# Vivado block design design_1, xcku5p-ffvb676-2-e, Vivado 2018.1_AR73068
# (continued, part 2 of 4)
current_bd_instance /ShaderCoreSystem

create_bd_cell -type ip -vlnv xilinx.com:ip:blk_mem_gen:8.4 VB_Cache
set_property -dict [list \
  CONFIG.Enable_32bit_Address false \
  CONFIG.Use_Byte_Write_Enable false \
  CONFIG.Write_Depth_A 1024 \
  CONFIG.Operating_Mode_A NO_CHANGE \
  CONFIG.Register_PortA_Output_of_Memory_Primitives false \
  CONFIG.Use_RSTA_Pin false \
  CONFIG.use_bram_block Stand_Alone \
] [get_bd_cells VB_Cache]
create_bd_cell -type ip -vlnv xilinx.com:ip:blk_mem_gen:8.4 InstructionCache
set_property -dict [list \
  CONFIG.Enable_32bit_Address false \
  CONFIG.Use_Byte_Write_Enable false \
  CONFIG.Write_Width_A 64 \
  CONFIG.Write_Depth_A 512 \
  CONFIG.Read_Width_A 64 \
  CONFIG.Operating_Mode_A NO_CHANGE \
  CONFIG.Register_PortA_Output_of_Memory_Primitives true \
  CONFIG.Register_PortA_Output_of_Memory_Core true \
  CONFIG.Use_RSTA_Pin false \
  CONFIG.use_bram_block Stand_Alone \
] [get_bd_cells InstructionCache]
create_bd_cell -type hier GPRQuadSystem
create_bd_cell -type ip -vlnv xilinx.com:ip:blk_mem_gen:8.4 ConstantBuffer_BRAM
set_property -dict [list \
  CONFIG.Enable_32bit_Address false \
  CONFIG.Use_Byte_Write_Enable false \
  CONFIG.Write_Depth_A 1024 \
  CONFIG.Operating_Mode_A NO_CHANGE \
  CONFIG.Register_PortA_Output_of_Memory_Primitives true \
  CONFIG.Register_PortA_Output_of_Memory_Core true \
  CONFIG.Use_RSTA_Pin false \
  CONFIG.use_bram_block Stand_Alone \
] [get_bd_cells ConstantBuffer_BRAM]
create_bd_cell -type module -reference UNORM8ToFloat UNORM8ToFloat_0
create_bd_cell -type module -reference VertexStreamCache VertexStreamCache_0
create_bd_cell -type module -reference ConstantBuffer ConstantBuffer_0
create_bd_cell -type module -reference FloatALU FloatALU_0
create_bd_cell -type module -reference FloatALU FloatALU_1
create_bd_cell -type module -reference FloatALU FloatALU_2
create_bd_cell -type module -reference FloatALU FloatALU_3
create_bd_cell -type module -reference ShaderCore ShaderCore_0

# ---- hierarchy /ShaderCoreSystem/GPRQuadSystem ----
current_bd_instance /ShaderCoreSystem/GPRQuadSystem
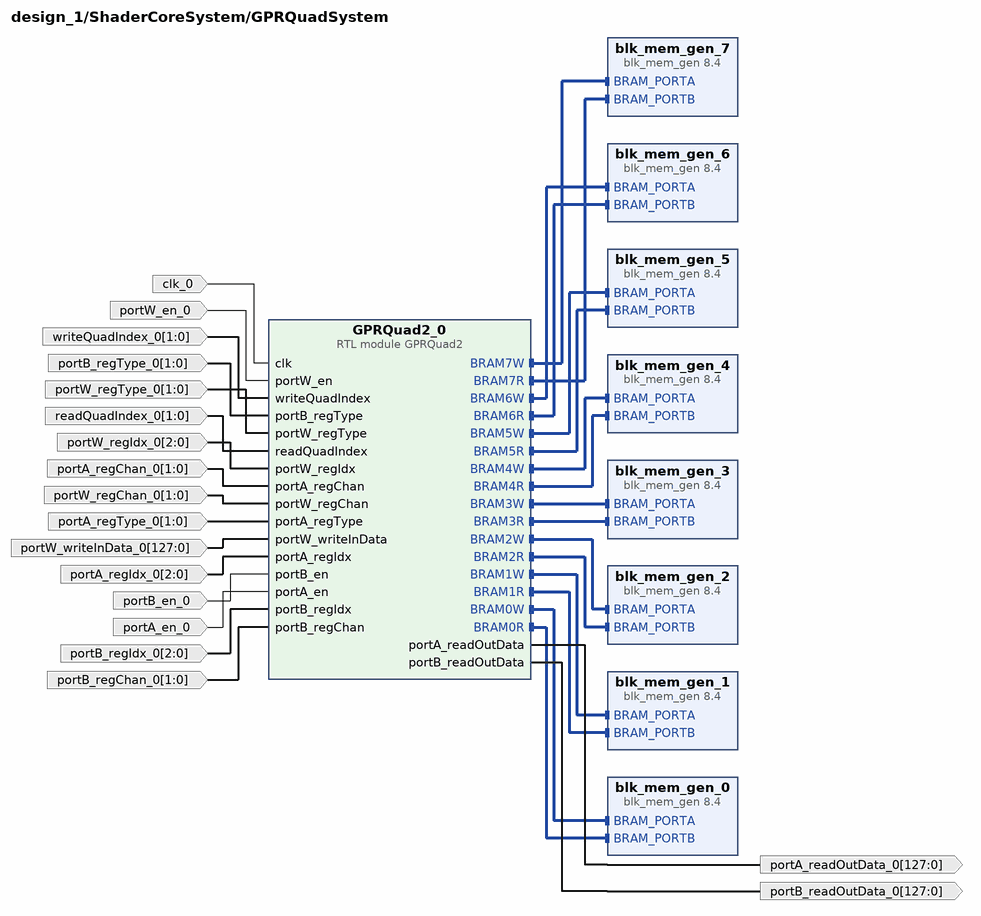
[diagram p8: block diagram inside /ShaderCoreSystem/GPRQuadSystem]
create_bd_pin -dir I -type clk clk_0
create_bd_pin -dir I portW_en_0
create_bd_pin -dir I -from 1 -to 0 writeQuadIndex_0
create_bd_pin -dir I -from 1 -to 0 portB_regType_0
create_bd_pin -dir I -from 1 -to 0 portW_regType_0
create_bd_pin -dir I -from 1 -to 0 readQuadIndex_0
create_bd_pin -dir I -from 2 -to 0 portW_regIdx_0
create_bd_pin -dir I -from 1 -to 0 portA_regChan_0
create_bd_pin -dir O -from 127 -to 0 portA_readOutData_0
create_bd_pin -dir I -from 1 -to 0 portW_regChan_0
create_bd_pin -dir I -from 1 -to 0 portA_regType_0
create_bd_pin -dir I -from 127 -to 0 portW_writeInData_0
create_bd_pin -dir I -from 2 -to 0 portA_regIdx_0
create_bd_pin -dir I portB_en_0
create_bd_pin -dir I portA_en_0
create_bd_pin -dir I -from 2 -to 0 portB_regIdx_0
create_bd_pin -dir I -from 1 -to 0 portB_regChan_0
create_bd_pin -dir O -from 127 -to 0 portB_readOutData_0

create_bd_cell -type ip -vlnv xilinx.com:ip:blk_mem_gen:8.4 blk_mem_gen_0
set_property -dict [list \
  CONFIG.Memory_Type Simple_Dual_Port_RAM \
  CONFIG.Enable_32bit_Address false \
  CONFIG.Use_Byte_Write_Enable false \
  CONFIG.Write_Depth_A 512 \
  CONFIG.Operating_Mode_A NO_CHANGE \
  CONFIG.Enable_B Use_ENB_Pin \
  CONFIG.Register_PortB_Output_of_Memory_Primitives true \
  CONFIG.Register_PortB_Output_of_Memory_Core true \
  CONFIG.Port_B_Clock 100 \
  CONFIG.Port_B_Enable_Rate 100 \
  CONFIG.use_bram_block Stand_Alone \
] [get_bd_cells blk_mem_gen_0]
create_bd_cell -type ip -vlnv xilinx.com:ip:blk_mem_gen:8.4 blk_mem_gen_1
set_property -dict [list \
  CONFIG.Memory_Type Simple_Dual_Port_RAM \
  CONFIG.Enable_32bit_Address false \
  CONFIG.Use_Byte_Write_Enable false \
  CONFIG.Write_Depth_A 512 \
  CONFIG.Operating_Mode_A NO_CHANGE \
  CONFIG.Enable_B Use_ENB_Pin \
  CONFIG.Register_PortB_Output_of_Memory_Primitives true \
  CONFIG.Register_PortB_Output_of_Memory_Core true \
  CONFIG.Port_B_Clock 100 \
  CONFIG.Port_B_Enable_Rate 100 \
  CONFIG.use_bram_block Stand_Alone \
] [get_bd_cells blk_mem_gen_1]
create_bd_cell -type ip -vlnv xilinx.com:ip:blk_mem_gen:8.4 blk_mem_gen_2
set_property -dict [list \
  CONFIG.Memory_Type Simple_Dual_Port_RAM \
  CONFIG.Enable_32bit_Address false \
  CONFIG.Use_Byte_Write_Enable false \
  CONFIG.Write_Depth_A 512 \
  CONFIG.Operating_Mode_A NO_CHANGE \
  CONFIG.Enable_B Use_ENB_Pin \
  CONFIG.Register_PortB_Output_of_Memory_Primitives true \
  CONFIG.Register_PortB_Output_of_Memory_Core true \
  CONFIG.Port_B_Clock 100 \
  CONFIG.Port_B_Enable_Rate 100 \
  CONFIG.use_bram_block Stand_Alone \
] [get_bd_cells blk_mem_gen_2]
create_bd_cell -type ip -vlnv xilinx.com:ip:blk_mem_gen:8.4 blk_mem_gen_3
set_property -dict [list \
  CONFIG.Memory_Type Simple_Dual_Port_RAM \
  CONFIG.Enable_32bit_Address false \
  CONFIG.Use_Byte_Write_Enable false \
  CONFIG.Write_Depth_A 512 \
  CONFIG.Operating_Mode_A NO_CHANGE \
  CONFIG.Enable_B Use_ENB_Pin \
  CONFIG.Register_PortB_Output_of_Memory_Primitives true \
  CONFIG.Register_PortB_Output_of_Memory_Core true \
  CONFIG.Port_B_Clock 100 \
  CONFIG.Port_B_Enable_Rate 100 \
  CONFIG.use_bram_block Stand_Alone \
] [get_bd_cells blk_mem_gen_3]
create_bd_cell -type ip -vlnv xilinx.com:ip:blk_mem_gen:8.4 blk_mem_gen_4
set_property -dict [list \
  CONFIG.Memory_Type Simple_Dual_Port_RAM \
  CONFIG.Enable_32bit_Address false \
  CONFIG.Use_Byte_Write_Enable false \
  CONFIG.Write_Depth_A 512 \
  CONFIG.Operating_Mode_A NO_CHANGE \
  CONFIG.Enable_B Use_ENB_Pin \
  CONFIG.Register_PortB_Output_of_Memory_Primitives true \
  CONFIG.Register_PortB_Output_of_Memory_Core true \
  CONFIG.Port_B_Clock 100 \
  CONFIG.Port_B_Enable_Rate 100 \
  CONFIG.use_bram_block Stand_Alone \
] [get_bd_cells blk_mem_gen_4]
create_bd_cell -type ip -vlnv xilinx.com:ip:blk_mem_gen:8.4 blk_mem_gen_5
set_property -dict [list \
  CONFIG.Memory_Type Simple_Dual_Port_RAM \
  CONFIG.Enable_32bit_Address false \
  CONFIG.Use_Byte_Write_Enable false \
  CONFIG.Write_Depth_A 512 \
  CONFIG.Operating_Mode_A NO_CHANGE \
  CONFIG.Enable_B Use_ENB_Pin \
  CONFIG.Register_PortB_Output_of_Memory_Primitives true \
  CONFIG.Register_PortB_Output_of_Memory_Core true \
  CONFIG.Port_B_Clock 100 \
  CONFIG.Port_B_Enable_Rate 100 \
  CONFIG.use_bram_block Stand_Alone \
] [get_bd_cells blk_mem_gen_5]
create_bd_cell -type ip -vlnv xilinx.com:ip:blk_mem_gen:8.4 blk_mem_gen_6
set_property -dict [list \
  CONFIG.Memory_Type Simple_Dual_Port_RAM \
  CONFIG.Enable_32bit_Address false \
  CONFIG.Use_Byte_Write_Enable false \
  CONFIG.Write_Depth_A 512 \
  CONFIG.Operating_Mode_A NO_CHANGE \
  CONFIG.Enable_B Use_ENB_Pin \
  CONFIG.Register_PortB_Output_of_Memory_Primitives true \
  CONFIG.Register_PortB_Output_of_Memory_Core true \
  CONFIG.Port_B_Clock 100 \
  CONFIG.Port_B_Enable_Rate 100 \
  CONFIG.use_bram_block Stand_Alone \
] [get_bd_cells blk_mem_gen_6]
create_bd_cell -type ip -vlnv xilinx.com:ip:blk_mem_gen:8.4 blk_mem_gen_7
set_property -dict [list \
  CONFIG.Memory_Type Simple_Dual_Port_RAM \
  CONFIG.Enable_32bit_Address false \
  CONFIG.Use_Byte_Write_Enable false \
  CONFIG.Write_Depth_A 512 \
  CONFIG.Operating_Mode_A NO_CHANGE \
  CONFIG.Enable_B Use_ENB_Pin \
  CONFIG.Register_PortB_Output_of_Memory_Primitives true \
  CONFIG.Register_PortB_Output_of_Memory_Core true \
  CONFIG.Port_B_Clock 100 \
  CONFIG.Port_B_Enable_Rate 100 \
  CONFIG.use_bram_block Stand_Alone \
] [get_bd_cells blk_mem_gen_7]
create_bd_cell -type module -reference GPRQuad2 GPRQuad2_0

# ---- connections ----

current_bd_instance /MemorySystem
connect_bd_intf_net [get_bd_intf_pins MemoryController_0/ROPReadResponses] [get_bd_intf_pins ROPReadResponsesFIFO/FIFO_WRITE]
connect_bd_intf_net [get_bd_intf_pins MemoryController_0/ZStencilReadRequests] [get_bd_intf_pins ZStencilReadRequestsFIFO/FIFO_READ]
connect_bd_intf_net [get_bd_intf_pins ROPWriteRequestsFIFO/FIFO_READ] [get_bd_intf_pins MemoryController_0/ROPWriteRequests]
connect_bd_intf_net [get_bd_intf_pins MemoryController_0/CommandProcReadRequests] [get_bd_intf_pins CommandProcReadRequestsFIFO/FIFO_READ]
connect_bd_intf_net [get_bd_intf_pins MemoryController_0/ScanoutReadRequests] [get_bd_intf_pins ScanoutReadRequestsFIFO/FIFO_READ]
connect_bd_intf_net [get_bd_intf_pins MemoryController_0/ScanoutReadResponses] [get_bd_intf_pins ScanoutReadResponsesFIFO/FIFO_WRITE]
connect_bd_intf_net [get_bd_intf_pins MemoryController_0/ZStencilReadResponses] [get_bd_intf_pins ZStencilReadResponsesFIFO/FIFO_WRITE]
connect_bd_intf_net [get_bd_intf_pins ZStencilWriteRequestsFIFO/FIFO_READ] [get_bd_intf_pins MemoryController_0/ZStencilWriteRequests]
connect_bd_intf_net [get_bd_intf_pins MemoryController_0/CommandProcReadResponses] [get_bd_intf_pins CommandProcReadResponsesFIFO/FIFO_WRITE]
connect_bd_intf_net [get_bd_intf_pins CommandProcWriteRequestsFIFO/FIFO_READ] [get_bd_intf_pins MemoryController_0/CommandProcWriteRequests]
connect_bd_intf_net [get_bd_intf_pins MemoryController_0/TexFetchReadRequests] [get_bd_intf_pins TexFetchReadRequestsFIFO/FIFO_READ]
connect_bd_intf_net [get_bd_intf_pins MemoryController_0/TexFetchReadResponses] [get_bd_intf_pins TexFetchReadResponsesFIFO/FIFO_WRITE]
connect_bd_intf_net [get_bd_intf_pins MemoryController_0/ROPReadRequests] [get_bd_intf_pins ROPReadRequestsFIFO/FIFO_READ]
connect_bd_intf_net [get_bd_intf_pins ClearBlockWriteRequestsFIFO/FIFO_READ] [get_bd_intf_pins MemoryController_0/ClearBlockWriteRequests]
connect_bd_intf_net [get_bd_intf_pins ddr4_0/C0_DDR4_S_AXI] [get_bd_intf_pins MemoryController_0/M_AXI]
connect_bd_intf_net [get_bd_intf_pins VBCacheReadRequestsFIFO/FIFO_READ] [get_bd_intf_pins MemoryController_0/VBCacheReadRequests]
connect_bd_intf_net [get_bd_intf_pins VBCacheReadResponsesFIFO/FIFO_WRITE] [get_bd_intf_pins MemoryController_0/VBCacheReadResponses]
connect_bd_intf_net [get_bd_intf_pins IBCacheReadRequestsFIFO/FIFO_READ] [get_bd_intf_pins MemoryController_0/IBCacheReadRequests]
connect_bd_intf_net [get_bd_intf_pins IBCacheReadResponsesFIFO/FIFO_WRITE] [get_bd_intf_pins MemoryController_0/IBCacheReadResponses]
connect_bd_intf_net [get_bd_intf_pins PacketDMAReadRequestsFIFO/FIFO_READ] [get_bd_intf_pins MemoryController_0/PacketDMAReadRequests]
connect_bd_intf_net [get_bd_intf_pins PacketDMAReadResponsesFIFO/FIFO_WRITE] [get_bd_intf_pins MemoryController_0/PacketDMAReadResponses]
connect_bd_intf_net [get_bd_intf_pins PacketDMAWriteRequestsFIFO/FIFO_READ] [get_bd_intf_pins MemoryController_0/PacketDMAWriteRequests]
connect_bd_intf_net [get_bd_intf_pins StatsWriteRequestsFIFO/FIFO_READ] [get_bd_intf_pins MemoryController_0/StatsWriteRequests]
connect_bd_intf_net [get_bd_intf_pins default_sysclk1_300] [get_bd_intf_pins ddr4_0/C0_SYS_CLK]
connect_bd_intf_net [get_bd_intf_pins ddr4_sdram_c1] [get_bd_intf_pins ddr4_0/C0_DDR4]
connect_bd_intf_net [get_bd_intf_pins CommandProcReadRequestsFIFO] [get_bd_intf_pins CommandProcReadRequestsFIFO/FIFO_WRITE]
connect_bd_intf_net [get_bd_intf_pins CommandProcReadResponsesFIFO] [get_bd_intf_pins CommandProcReadResponsesFIFO/FIFO_READ]
connect_bd_intf_net [get_bd_intf_pins CommandProcWriteRequestsFIFO] [get_bd_intf_pins CommandProcWriteRequestsFIFO/FIFO_WRITE]
connect_bd_intf_net [get_bd_intf_pins TexFetchReadRequestsFIFO] [get_bd_intf_pins TexFetchReadRequestsFIFO/FIFO_WRITE]
connect_bd_intf_net [get_bd_intf_pins TexFetchReadResponsesFIFO] [get_bd_intf_pins TexFetchReadResponsesFIFO/FIFO_READ]
connect_bd_intf_net [get_bd_intf_pins ROPReadRequestsFIFO] [get_bd_intf_pins ROPReadRequestsFIFO/FIFO_WRITE]
connect_bd_intf_net [get_bd_intf_pins ROPReadResponsesFIFO] [get_bd_intf_pins ROPReadResponsesFIFO/FIFO_READ]
connect_bd_intf_net [get_bd_intf_pins ROPWriteRequestsFIFO] [get_bd_intf_pins ROPWriteRequestsFIFO/FIFO_WRITE]
connect_bd_intf_net [get_bd_intf_pins ScanoutReadRequestsFIFO] [get_bd_intf_pins ScanoutReadRequestsFIFO/FIFO_WRITE]
connect_bd_intf_net [get_bd_intf_pins ScanoutReadResponsesFIFO] [get_bd_intf_pins ScanoutReadResponsesFIFO/FIFO_READ]
connect_bd_intf_net [get_bd_intf_pins ClearBlockWriteRequestsFIFO] [get_bd_intf_pins ClearBlockWriteRequestsFIFO/FIFO_WRITE]
connect_bd_intf_net [get_bd_intf_pins VBCacheReadRequestsFIFO] [get_bd_intf_pins VBCacheReadRequestsFIFO/FIFO_WRITE]
connect_bd_intf_net [get_bd_intf_pins VBCacheReadResponsesFIFO] [get_bd_intf_pins VBCacheReadResponsesFIFO/FIFO_READ]
connect_bd_intf_net [get_bd_intf_pins IBCacheReadRequestsFIFO] [get_bd_intf_pins IBCacheReadRequestsFIFO/FIFO_WRITE]
connect_bd_intf_net [get_bd_intf_pins IBCacheReadResponsesFIFO] [get_bd_intf_pins IBCacheReadResponsesFIFO/FIFO_READ]
connect_bd_intf_net [get_bd_intf_pins StatsWriteRequestsFIFO] [get_bd_intf_pins StatsWriteRequestsFIFO/FIFO_WRITE]
connect_bd_net [get_bd_pins ddr4_0/c0_ddr4_ui_clk] \
  [get_bd_pins c0_ddr4_ui_clk] [get_bd_pins ScanoutReadRequestsFIFO/rd_clk] [get_bd_pins ZStencilReadRequestsFIFO/rd_clk] \
  [get_bd_pins ZStencilReadRequestsFIFO/wr_clk] [get_bd_pins ROPReadRequestsFIFO/wr_clk] \
  [get_bd_pins ROPReadResponsesFIFO/rd_clk] [get_bd_pins ROPWriteRequestsFIFO/wr_clk] \
  [get_bd_pins ClearBlockWriteRequestsFIFO/wr_clk] [get_bd_pins TexFetchReadResponsesFIFO/rd_clk] \
  [get_bd_pins TexFetchReadRequestsFIFO/wr_clk] [get_bd_pins VBCacheReadResponsesFIFO/rd_clk] \
  [get_bd_pins VBCacheReadRequestsFIFO/wr_clk] [get_bd_pins CommandProcWriteRequestsFIFO/wr_clk] \
  [get_bd_pins CommandProcReadResponsesFIFO/rd_clk] [get_bd_pins CommandProcReadRequestsFIFO/wr_clk] \
  [get_bd_pins ZStencilReadResponsesFIFO/rd_clk] [get_bd_pins ZStencilWriteRequestsFIFO/wr_clk] \
  [get_bd_pins ClearBlockWriteRequestsFIFO/rd_clk] [get_bd_pins ROPWriteRequestsFIFO/rd_clk] \
  [get_bd_pins ROPReadRequestsFIFO/rd_clk] [get_bd_pins TexFetchReadResponsesFIFO/wr_clk] \
  [get_bd_pins TexFetchReadRequestsFIFO/rd_clk] [get_bd_pins VBCacheReadResponsesFIFO/wr_clk] \
  [get_bd_pins VBCacheReadRequestsFIFO/rd_clk] [get_bd_pins CommandProcWriteRequestsFIFO/rd_clk] \
  [get_bd_pins CommandProcReadResponsesFIFO/wr_clk] [get_bd_pins CommandProcReadRequestsFIFO/rd_clk] \
  [get_bd_pins ZStencilWriteRequestsFIFO/rd_clk] [get_bd_pins ZStencilReadResponsesFIFO/wr_clk] \
  [get_bd_pins ScanoutReadResponsesFIFO/wr_clk] [get_bd_pins rst_ddr4_0_333M/slowest_sync_clk] \
  [get_bd_pins ROPReadResponsesFIFO/wr_clk] [get_bd_pins StatsWriteRequestsFIFO/wr_clk] \
  [get_bd_pins StatsWriteRequestsFIFO/rd_clk] [get_bd_pins IBCacheReadRequestsFIFO/wr_clk] \
  [get_bd_pins IBCacheReadRequestsFIFO/rd_clk] [get_bd_pins IBCacheReadResponsesFIFO/wr_clk] \
  [get_bd_pins IBCacheReadResponsesFIFO/rd_clk] [get_bd_pins PacketDMAReadRequestsFIFO/wr_clk] \
  [get_bd_pins PacketDMAReadRequestsFIFO/rd_clk] [get_bd_pins PacketDMAReadResponsesFIFO/wr_clk] \
  [get_bd_pins PacketDMAReadResponsesFIFO/rd_clk] [get_bd_pins MemoryController_0/M_AXI_ACLK] \
  [get_bd_pins PacketDMAWriteRequestsFIFO/wr_clk] [get_bd_pins PacketDMAWriteRequestsFIFO/rd_clk]
connect_bd_net -net ResetN_UntilClockLoc_0_resetn [get_bd_pins M_AXI_ARESETN] [get_bd_pins MemoryController_0/M_AXI_ARESETN]
connect_bd_net [get_bd_pins MemoryController_0/CMD_MemoryControllerIsIdle] [get_bd_pins CMD_MemoryControllerIsIdle]
connect_bd_net [get_bd_pins rd_clk] [get_bd_pins ScanoutReadResponsesFIFO/rd_clk] [get_bd_pins ScanoutReadRequestsFIFO/wr_clk]
connect_bd_net [get_bd_pins MemoryController_0/DBG_ReadControlState] [get_bd_pins DBG_ReadControlState]
connect_bd_net [get_bd_pins MemoryController_0/DBG_WriteControlState] [get_bd_pins DBG_WriteControlState]
connect_bd_net [get_bd_pins MemoryController_0/DBG_ScanoutReadRequests_Empty] [get_bd_pins DBG_ScanoutReadRequests_Empty]
connect_bd_net [get_bd_pins MemoryController_0/DBG_ScanoutReadResponses_Full] [get_bd_pins DBG_ScanoutReadResponses_Full]
connect_bd_net [get_bd_pins MemoryController_0/DBG_ScanoutReadRequests_rd_en] [get_bd_pins DBG_ScanoutReadRequests_rd_en]
connect_bd_net [get_bd_pins MemoryController_0/DBG_LastWriteAddress] [get_bd_pins DBG_LastWriteAddress]
connect_bd_net [get_bd_pins MemoryController_0/DBG_LastWriteData] [get_bd_pins DBG_LastWriteData]
connect_bd_net [get_bd_pins MemoryController_0/DBG_LastWriteDataDWORDEnables] [get_bd_pins DBG_LastWriteDataDWORDEnables]
connect_bd_net [get_bd_pins MemoryController_0/DBG_LastReadAddress] [get_bd_pins DBG_LastReadAddress]
connect_bd_net [get_bd_pins MemoryController_0/STAT_MemReadCyclesIdle] [get_bd_pins STAT_MemReadCyclesIdle]
connect_bd_net [get_bd_pins MemoryController_0/STAT_MemReadCyclesSpentWorking] [get_bd_pins STAT_MemReadCyclesSpentWorking]
connect_bd_net [get_bd_pins MemoryController_0/STAT_MemWriteCyclesIdle] [get_bd_pins STAT_MemWriteCyclesIdle]
connect_bd_net [get_bd_pins MemoryController_0/STAT_MemWriteCyclesSpentWorking] [get_bd_pins STAT_MemWriteCyclesSpentWorking]
connect_bd_net [get_bd_pins MemoryController_0/STAT_MemReadCountBytesTransferred] [get_bd_pins STAT_MemReadCountBytesTransferred]
connect_bd_net [get_bd_pins MemoryController_0/STAT_MemReadCountTransactions] [get_bd_pins STAT_MemReadCountTransactions]
connect_bd_net [get_bd_pins MemoryController_0/STAT_MemWriteCountBytesTransferred] [get_bd_pins STAT_MemWriteCountBytesTransferred]
connect_bd_net [get_bd_pins MemoryController_0/STAT_MemWriteCountTransactions] [get_bd_pins STAT_MemWriteCountTransactions]
connect_bd_net [get_bd_pins MemoryController_0/STAT_MemReadCountNonScanoutBytesTransferred] [get_bd_pins STAT_MemReadCountNonScanoutBytesTransferred]
connect_bd_net [get_bd_pins MemoryController_0/STAT_MemReadCountNonScanoutTransactions] [get_bd_pins STAT_MemReadCountNonScanoutTransactions]
connect_bd_net [get_bd_pins MemoryController_0/DBG_LastWriteMemoryClientIndex] [get_bd_pins DBG_LastWriteMemoryClientIndex]
connect_bd_net [get_bd_pins MemoryController_0/DBG_LastReadMemoryClientIndex] [get_bd_pins DBG_LastReadMemoryClientIndex]
connect_bd_net [get_bd_pins MemoryController_0/DBG_ReadRequestsEmptyBitmask] [get_bd_pins DBG_ReadRequestsEmptyBitmask]
connect_bd_net [get_bd_pins MemoryController_0/DBG_ReadResponsesFullBitmask] [get_bd_pins DBG_ReadResponsesFullBitmask]
connect_bd_net [get_bd_pins ddr4_0/c0_init_calib_complete] [get_bd_pins MemoryController_0/c0_init_calib_complete]
connect_bd_net [get_bd_pins rst_ddr4_0_333M/peripheral_aresetn] [get_bd_pins ddr4_0/c0_ddr4_aresetn]
connect_bd_net [get_bd_pins reset] [get_bd_pins ddr4_0/sys_rst]
connect_bd_net [get_bd_pins ddr4_0/addn_ui_clkout1] [get_bd_pins addn_ui_clkout1]
connect_bd_net [get_bd_pins ddr4_0/c0_ddr4_ui_clk_sync_rst] [get_bd_pins rst_ddr4_0_333M/ext_reset_in]
connect_bd_net [get_bd_pins MemoryController_0/DBG_WriteRequestsEmptyBitmask] [get_bd_pins DBG_WriteRequestsEmptyBitmask]

current_bd_instance /SerialPacketSystem
connect_bd_intf_net [get_bd_intf_pins PacketProcessor_0/FIFO_IN_RETURN_PACKETS] [get_bd_intf_pins ReturnOutputPacketsFIFO/FIFO_READ]
connect_bd_intf_net [get_bd_intf_pins PacketProcessor_0/FIFO_OUT_VALID_PACKETS] [get_bd_intf_pins ValidIncomingPacketsFIFO/FIFO_WRITE]
connect_bd_intf_net [get_bd_intf_pins PacketProcessor_0/M_AXI] [get_bd_intf_pins axi_uartlite_0/S_AXI]
connect_bd_intf_net [get_bd_intf_pins FIFO_WRITE] [get_bd_intf_pins ReturnOutputPacketsFIFO/FIFO_WRITE]
connect_bd_intf_net [get_bd_intf_pins FIFO_READ] [get_bd_intf_pins ValidIncomingPacketsFIFO/FIFO_READ]
connect_bd_intf_net [get_bd_intf_pins rs232_uart] [get_bd_intf_pins axi_uartlite_0/UART]
connect_bd_net [get_bd_pins reset] [get_bd_pins ValidIncomingPacketsFIFO/srst] [get_bd_pins ReturnOutputPacketsFIFO/srst]
connect_bd_net -net ddr4_0_c0_ddr4_ui_clk [get_bd_pins rd_clk] \
  [get_bd_pins ValidIncomingPacketsFIFO/rd_clk] [get_bd_pins ReturnOutputPacketsFIFO/wr_clk]
connect_bd_net -net ddr4_0_addn_ui_clkout1 [get_bd_pins s_axi_aclk] \
  [get_bd_pins ValidIncomingPacketsFIFO/wr_clk] [get_bd_pins ReturnOutputPacketsFIFO/rd_clk] [get_bd_pins ila_250/clk] \
  [get_bd_pins axi_uartlite_0/s_axi_aclk] [get_bd_pins PacketProcessor_0/M_AXI_ACLK]
connect_bd_net -net ResetN_UntilClockLoc_0_resetn [get_bd_pins s_axi_aresetn] \
  [get_bd_pins axi_uartlite_0/s_axi_aresetn] [get_bd_pins PacketProcessor_0/M_AXI_ARESETN]
connect_bd_net [get_bd_pins PacketProcessor_0/DBG_INCPACKETBUFFER] [get_bd_pins ila_250/probe1]
connect_bd_net [get_bd_pins PacketProcessor_0/DBG_PACKETSTATE] [get_bd_pins ila_250/probe0]

current_bd_instance /ScanoutSystem
connect_bd_intf_net [get_bd_intf_pins ScanoutReadRequestsFIFO] [get_bd_intf_pins ScanOut_0/ScanoutReadRequestsFIFO]
connect_bd_intf_net [get_bd_intf_pins ScanoutReadResponses] [get_bd_intf_pins ScanOut_0/ScanoutReadResponses]
connect_bd_net -net clk_wiz_0_clk_out1 [get_bd_pins scanout_clk_25_175_x10/clk_x10] \
  [get_bd_pins clk_out1] [get_bd_pins CDC_Command_Scanout_0/scanout_clk] [get_bd_pins ScanOut_0/clk_x10] \
  [get_bd_pins dvid_0/clk_x10]
connect_bd_net -net CommandProcessor_0_SCANOUT_RenderTargetBaseAddr [get_bd_pins CMD_BaseRenderTargetAddr] \
  [get_bd_pins CDC_Command_Scanout_0/CMD_RenderTargetBaseAddr]
connect_bd_net [get_bd_pins ScanOut_0/hsync] [get_bd_pins dvid_0/hsync]
connect_bd_net -net ddr4_0_c0_ddr4_ui_clk [get_bd_pins clk_in1] [get_bd_pins scanout_clk_25_175_x10/clk_in1]
connect_bd_net [get_bd_pins CMD_ScanoutEnable] [get_bd_pins CDC_Command_Scanout_0/CMD_ScanEnable]
connect_bd_net [get_bd_pins reset] [get_bd_pins scanout_clk_25_175_x10/reset]
connect_bd_net [get_bd_pins dvid_0/red_s] [get_bd_pins obuf_outputs_0/red_s]
connect_bd_net [get_bd_pins dvid_0/green_s] [get_bd_pins obuf_outputs_0/green_s]
connect_bd_net [get_bd_pins dvid_0/blue_s] [get_bd_pins obuf_outputs_0/blue_s]
connect_bd_net [get_bd_pins dvid_0/cl_s] [get_bd_pins obuf_outputs_0/cl_s]
connect_bd_net [get_bd_pins obuf_outputs_0/out_blue_p] [get_bd_pins out_blue_p]
connect_bd_net [get_bd_pins obuf_outputs_0/out_blue_n] [get_bd_pins out_blue_n]
connect_bd_net [get_bd_pins obuf_outputs_0/out_green_p] [get_bd_pins out_green_p]
connect_bd_net [get_bd_pins obuf_outputs_0/out_green_n] [get_bd_pins out_green_n]
connect_bd_net [get_bd_pins obuf_outputs_0/out_red_p] [get_bd_pins out_red_p]
connect_bd_net [get_bd_pins obuf_outputs_0/out_red_n] [get_bd_pins out_red_n]
connect_bd_net [get_bd_pins obuf_outputs_0/out_cl_p] [get_bd_pins out_cl_p]
connect_bd_net [get_bd_pins obuf_outputs_0/out_cl_n] [get_bd_pins out_cl_n]
connect_bd_net [get_bd_pins ScanOut_0/outR] [get_bd_pins dvid_0/red_p]
connect_bd_net [get_bd_pins ScanOut_0/outG] [get_bd_pins dvid_0/green_p]
connect_bd_net [get_bd_pins ScanOut_0/outB] [get_bd_pins dvid_0/blue_p]
connect_bd_net [get_bd_pins ScanOut_0/blank] [get_bd_pins dvid_0/blank]
connect_bd_net [get_bd_pins ScanOut_0/vsync] [get_bd_pins CDC_Command_Scanout_0/SCANOUT_VSync] [get_bd_pins dvid_0/vsync]
connect_bd_net [get_bd_pins CMD_InvertOutputColor] [get_bd_pins CDC_Command_Scanout_0/CMD_InvertOutputColor]
connect_bd_net [get_bd_pins CMD_OutputColorChannels] [get_bd_pins CDC_Command_Scanout_0/CMD_OutputColorChannels]
connect_bd_net [get_bd_pins ScanOut_0/out_scanout_enable] [get_bd_pins dvid_0/scanout_en]
connect_bd_net [get_bd_pins CDC_Command_Scanout_0/SCANOUT_RenderTargetBaseAddr] [get_bd_pins ScanOut_0/CMD_BaseRenderTargetAddr]
connect_bd_net [get_bd_pins CDC_Command_Scanout_0/SCANOUT_ScanEnable] [get_bd_pins ScanOut_0/CMD_ScanoutEnable]
connect_bd_net [get_bd_pins CDC_Command_Scanout_0/SCANOUT_InvertOutputColor] [get_bd_pins ScanOut_0/CMD_InvertOutputColor]
connect_bd_net [get_bd_pins CDC_Command_Scanout_0/SCANOUT_OutputColorChannels] [get_bd_pins ScanOut_0/CMD_OutputColorChannels]
connect_bd_net [get_bd_pins CDC_Command_Scanout_0/CMD_VSync] [get_bd_pins CMD_VSync]
connect_bd_net [get_bd_pins cmd_clk] [get_bd_pins CDC_Command_Scanout_0/cmd_clk]
connect_bd_net [get_bd_pins ScanOut_0/guardBandEnable] [get_bd_pins dvid_0/guardBandEnable]
connect_bd_net [get_bd_pins ScanOut_0/guardBandType] [get_bd_pins dvid_0/guardBandType]
connect_bd_net [get_bd_pins ScanOut_0/controlChannel0Blue] [get_bd_pins dvid_0/controlChannel0Blue]
connect_bd_net [get_bd_pins ScanOut_0/controlChannel1Green] [get_bd_pins dvid_0/controlChannel1Green]
connect_bd_net [get_bd_pins ScanOut_0/controlChannel2Red] [get_bd_pins dvid_0/controlChannel2Red]
connect_bd_net [get_bd_pins ScanOut_0/isTERC4Region] [get_bd_pins dvid_0/isTERC4Region]
connect_bd_net [get_bd_pins ScanOut_0/TERC4Character0] [get_bd_pins dvid_0/TERC4Character0]
connect_bd_net [get_bd_pins ScanOut_0/TERC4Character1] [get_bd_pins dvid_0/TERC4Character1]
connect_bd_net [get_bd_pins ScanOut_0/TERC4Character2] [get_bd_pins dvid_0/TERC4Character2]
connect_bd_net [get_bd_pins VSyncPolarity0/dout] [get_bd_pins ScanOut_0/VSyncActivePolarity]
connect_bd_net [get_bd_pins HSyncPolarity0/dout] [get_bd_pins ScanOut_0/HSyncActivePolarity]
connect_bd_net [get_bd_pins scanout_clk_25_175_x10/clk_x10n] [get_bd_pins dvid_0/clk_x10n]
connect_bd_net [get_bd_pins scanout_clk_25_175_x10/pixelclk_x1] [get_bd_pins dvid_0/clk_pixel_x1]

current_bd_instance /ShaderCoreSystem
connect_bd_intf_net [get_bd_intf_pins ConstantBuffer_0/ConstBufferBRAM] [get_bd_intf_pins ConstantBuffer_BRAM/BRAM_PORTA]
connect_bd_intf_net [get_bd_intf_pins VertexStreamCache_0/VBCache] [get_bd_intf_pins VB_Cache/BRAM_PORTA]
connect_bd_intf_net [get_bd_intf_pins VERTBATCH_FIFO_0] [get_bd_intf_pins ShaderCore_0/VERTBATCH_FIFO]
connect_bd_intf_net [get_bd_intf_pins VERTOUT_FIFO_0] [get_bd_intf_pins ShaderCore_0/VERTOUT_FIFO]
connect_bd_intf_net [get_bd_intf_pins VBCacheReadRequests_0] [get_bd_intf_pins VertexStreamCache_0/VBCacheReadRequests]
connect_bd_intf_net [get_bd_intf_pins VBCacheReadResponses_0] [get_bd_intf_pins VertexStreamCache_0/VBCacheReadResponses]
connect_bd_intf_net [get_bd_intf_pins INDEXOUT_FIFO] [get_bd_intf_pins ShaderCore_0/INDEXOUT_FIFO]
connect_bd_net -net clk_0_1 [get_bd_pins clk_0] \
  [get_bd_pins InstructionCache/clka] [get_bd_pins UNORM8ToFloat_0/clk] [get_bd_pins VertexStreamCache_0/clk] \
  [get_bd_pins ConstantBuffer_0/clk] [get_bd_pins FloatALU_0/clk] [get_bd_pins FloatALU_1/clk] [get_bd_pins FloatALU_2/clk] \
  [get_bd_pins FloatALU_3/clk] [get_bd_pins GPRQuadSystem/clk_0] [get_bd_pins ShaderCore_0/clk]
connect_bd_net [get_bd_pins ConstantBuffer_0/readOutData] [get_bd_pins readOutData] [get_bd_pins ShaderCore_0/CB_ReadOutData]
connect_bd_net [get_bd_pins ShaderCore_0/ICache_Enable] [get_bd_pins InstructionCache/ena]
connect_bd_net [get_bd_pins ShaderCore_0/ICache_WriteMode] [get_bd_pins InstructionCache/wea]
connect_bd_net [get_bd_pins ShaderCore_0/ICache_Address] [get_bd_pins InstructionCache/addra]
connect_bd_net -net blk_mem_gen_1_douta [get_bd_pins InstructionCache/douta] [get_bd_pins ShaderCore_0/ICache_ReadData]
connect_bd_net [get_bd_pins ShaderCore_0/ICache_WriteData] [get_bd_pins InstructionCache/dina]
connect_bd_net [get_bd_pins VertexStreamCache_0/VSC_ReadReady] [get_bd_pins VSC_ReadReady] [get_bd_pins ShaderCore_0/VSC_ReadReady]
connect_bd_net [get_bd_pins VertexStreamCache_0/VSC_ReadData] [get_bd_pins VSC_ReadData] [get_bd_pins ShaderCore_0/VSC_ReadData]
connect_bd_net [get_bd_pins ShaderCore_0/FPU0_IN_A] [get_bd_pins FPU0_IN_A] [get_bd_pins FloatALU_0/IN_A]
connect_bd_net [get_bd_pins ShaderCore_0/FPU0_IN_B] [get_bd_pins FPU0_IN_B] [get_bd_pins FloatALU_0/IN_B]
connect_bd_net [get_bd_pins ShaderCore_0/FPU1_IN_A] [get_bd_pins FPU1_IN_A] [get_bd_pins FloatALU_1/IN_A]
connect_bd_net [get_bd_pins ShaderCore_0/FPU1_IN_B] [get_bd_pins FPU1_IN_B] [get_bd_pins FloatALU_1/IN_B]
connect_bd_net [get_bd_pins ShaderCore_0/FPU2_IN_A] [get_bd_pins FloatALU_2/IN_A]
connect_bd_net [get_bd_pins ShaderCore_0/FPU2_IN_B] [get_bd_pins FloatALU_2/IN_B]
connect_bd_net [get_bd_pins ShaderCore_0/FPU3_IN_A] [get_bd_pins FPU3_IN_A] [get_bd_pins FloatALU_3/IN_A]
connect_bd_net [get_bd_pins ShaderCore_0/FPU3_IN_B] [get_bd_pins FPU3_IN_B] [get_bd_pins FloatALU_3/IN_B]
connect_bd_net [get_bd_pins ShaderCore_0/UNORM8ToFloat_Enable] [get_bd_pins UNORM8ToFloat_0/Enable]
connect_bd_net [get_bd_pins ShaderCore_0/UNORM8ToFloat_ColorIn] [get_bd_pins UNORM8ToFloat_0/D3DColorIn]
connect_bd_net [get_bd_pins FloatALU_0/OUT_RESULT] [get_bd_pins OUT_RESULT] [get_bd_pins ShaderCore_0/FPU0_OUT_RESULT]
connect_bd_net [get_bd_pins FloatALU_1/OUT_RESULT] [get_bd_pins OUT_RESULT1] [get_bd_pins ShaderCore_0/FPU1_OUT_RESULT]
connect_bd_net [get_bd_pins FloatALU_2/OUT_RESULT] [get_bd_pins ShaderCore_0/FPU2_OUT_RESULT]
connect_bd_net [get_bd_pins FloatALU_3/OUT_RESULT] [get_bd_pins OUT_RESULT2] [get_bd_pins ShaderCore_0/FPU3_OUT_RESULT]
connect_bd_net [get_bd_pins UNORM8ToFloat_0/FloatXOut] [get_bd_pins ShaderCore_0/UNORM8ToFloat_ConvertedX]
connect_bd_net [get_bd_pins UNORM8ToFloat_0/FloatYOut] [get_bd_pins ShaderCore_0/UNORM8ToFloat_ConvertedY]
connect_bd_net [get_bd_pins UNORM8ToFloat_0/FloatZOut] [get_bd_pins ShaderCore_0/UNORM8ToFloat_ConvertedZ]
connect_bd_net [get_bd_pins UNORM8ToFloat_0/FloatWOut] [get_bd_pins ShaderCore_0/UNORM8ToFloat_ConvertedW]
connect_bd_net [get_bd_pins GPRQuadSystem/portA_readOutData_0] [get_bd_pins portA_readOutData_0] [get_bd_pins ShaderCore_0/GPR0_PortA_readOutData]
connect_bd_net [get_bd_pins GPRQuadSystem/portB_readOutData_0] [get_bd_pins portB_readOutData_0] [get_bd_pins ShaderCore_0/GPR0_PortB_readOutData]
connect_bd_net -net portW_writeInData_0_1 [get_bd_pins ShaderCore_0/GPR0_PortW_writeInData] \
  [get_bd_pins GPR0_PortW_writeInData] [get_bd_pins GPRQuadSystem/portW_writeInData_0]
connect_bd_net -net portW_en_0_1 [get_bd_pins ShaderCore_0/GPR0_PortW_en] [get_bd_pins GPR0_PortW_en] [get_bd_pins GPRQuadSystem/portW_en_0]
connect_bd_net -net writeQuadIndex_0_1 [get_bd_pins ShaderCore_0/GPR0_WriteQuadIndex] \
  [get_bd_pins GPR0_WriteQuadIndex] [get_bd_pins GPRQuadSystem/writeQuadIndex_0]
connect_bd_net -net portB_regType_0_1 [get_bd_pins ShaderCore_0/GPR0_PortB_regType] \
  [get_bd_pins GPR0_PortB_regType] [get_bd_pins GPRQuadSystem/portB_regType_0]
connect_bd_net -net portW_regType_0_1 [get_bd_pins ShaderCore_0/GPR0_PortW_regType] [get_bd_pins GPRQuadSystem/portW_regType_0]
connect_bd_net -net readQuadIndex_0_1 [get_bd_pins ShaderCore_0/GPR0_ReadQuadIndex] \
  [get_bd_pins GPR0_ReadQuadIndex] [get_bd_pins GPRQuadSystem/readQuadIndex_0]
connect_bd_net -net portW_regIdx_0_1 [get_bd_pins ShaderCore_0/GPR0_PortW_regIdx] [get_bd_pins GPRQuadSystem/portW_regIdx_0]
connect_bd_net -net portA_regChan_0_1 [get_bd_pins ShaderCore_0/GPR0_PortA_regChan] \
  [get_bd_pins GPR0_PortA_regChan] [get_bd_pins GPRQuadSystem/portA_regChan_0]
connect_bd_net -net portW_regChan_0_1 [get_bd_pins ShaderCore_0/GPR0_PortW_regChan] [get_bd_pins GPRQuadSystem/portW_regChan_0]
connect_bd_net -net portA_regType_0_1 [get_bd_pins ShaderCore_0/GPR0_PortA_regType] \
  [get_bd_pins GPR0_PortA_regType] [get_bd_pins GPRQuadSystem/portA_regType_0]
connect_bd_net -net portA_regIdx_0_1 [get_bd_pins ShaderCore_0/GPR0_PortA_regIdx] \
  [get_bd_pins GPR0_PortA_regIdx] [get_bd_pins GPRQuadSystem/portA_regIdx_0]
connect_bd_net -net portB_en_0_1 [get_bd_pins ShaderCore_0/GPR0_PortB_en] [get_bd_pins GPR0_PortB_en] [get_bd_pins GPRQuadSystem/portB_en_0]
connect_bd_net -net portA_en_0_1 [get_bd_pins ShaderCore_0/GPR0_PortA_en] [get_bd_pins GPR0_PortA_en] [get_bd_pins GPRQuadSystem/portA_en_0]
connect_bd_net -net portB_regIdx_0_1 [get_bd_pins ShaderCore_0/GPR0_PortB_regIdx] \
  [get_bd_pins GPR0_PortB_regIdx] [get_bd_pins GPRQuadSystem/portB_regIdx_0]
connect_bd_net -net portB_regChan_0_1 [get_bd_pins ShaderCore_0/GPR0_PortB_regChan] \
  [get_bd_pins GPR0_PortB_regChan] [get_bd_pins GPRQuadSystem/portB_regChan_0]
connect_bd_net [get_bd_pins ShaderCore_0/CB_Enable] [get_bd_pins CB_Enable] [get_bd_pins ConstantBuffer_0/enable]
connect_bd_net [get_bd_pins ShaderCore_0/CB_WriteMode] [get_bd_pins CB_WriteMode] [get_bd_pins ConstantBuffer_0/writeMode]
connect_bd_net [get_bd_pins ShaderCore_0/CB_RegIndex] [get_bd_pins CB_RegIndex] [get_bd_pins ConstantBuffer_0/regIndex]
connect_bd_net [get_bd_pins ShaderCore_0/CB_RegComponent] [get_bd_pins CB_RegComponent] [get_bd_pins ConstantBuffer_0/regComponent]
connect_bd_net [get_bd_pins ShaderCore_0/CB_WriteInData] [get_bd_pins CB_WriteInData] [get_bd_pins ConstantBuffer_0/writeInData]
connect_bd_net [get_bd_pins ShaderCore_0/VSC_ReadEnable] [get_bd_pins VertexStreamCache_0/VSC_ReadEnable]
connect_bd_net [get_bd_pins ShaderCore_0/VSC_ReadStreamIndex] [get_bd_pins VertexStreamCache_0/VSC_ReadStreamIndex]
connect_bd_net [get_bd_pins ShaderCore_0/VSC_ReadDWORDAddr] [get_bd_pins VSC_ReadDWORDAddr] [get_bd_pins VertexStreamCache_0/VSC_ReadDWORDAddr]
connect_bd_net [get_bd_pins ShaderCore_0/VSC_SetStreamVBAddress] [get_bd_pins VertexStreamCache_0/VSC_SetStreamVBAddress]
connect_bd_net [get_bd_pins ShaderCore_0/VSC_StreamIndex] [get_bd_pins VertexStreamCache_0/VSC_StreamIndex]
connect_bd_net [get_bd_pins ShaderCore_0/VSC_StreamVBAddress] [get_bd_pins VSC_StreamVBAddress] [get_bd_pins VertexStreamCache_0/VSC_StreamVBAddress]
connect_bd_net [get_bd_pins ShaderCore_0/VSC_InvalidateCache] [get_bd_pins VertexStreamCache_0/VSC_InvalidateCache]
connect_bd_net -net CMD_SetVertexStreamIsD3DCOLOR_0_1 [get_bd_pins CMD_SetVertexStreamIsD3DCOLOR_0] \
  [get_bd_pins ShaderCore_0/CMD_SetVertexStreamIsD3DCOLOR]
connect_bd_net -net CMD_SetConstantIndex_0_1 [get_bd_pins CMD_SetConstantIndex_0] [get_bd_pins ShaderCore_0/CMD_SetConstantIndex]
connect_bd_net -net CMD_LoadProgramLen_0_1 [get_bd_pins CMD_LoadProgramLen_0] [get_bd_pins ShaderCore_0/CMD_LoadProgramLen]
connect_bd_net -net CMD_SetNumVertexStreams_0_1 [get_bd_pins CMD_SetNumVertexStreams_0] [get_bd_pins ShaderCore_0/CMD_SetNumVertexStreams]
connect_bd_net -net CMD_SetVertexStreamDWORDOffset_0_1 [get_bd_pins CMD_SetVertexStreamDWORDOffset_0] \
  [get_bd_pins ShaderCore_0/CMD_SetVertexStreamDWORDOffset]
connect_bd_net -net CMD_SetVertexStreamDWORDStride_0_1 [get_bd_pins CMD_SetVertexStreamDWORDStride_0] \
  [get_bd_pins ShaderCore_0/CMD_SetVertexStreamDWORDStride]
connect_bd_net -net CMD_SetConstantData_0_1 [get_bd_pins CMD_SetConstantData_0] [get_bd_pins ShaderCore_0/CMD_SetConstantData]
connect_bd_net [get_bd_pins ShaderCore_0/CMD_IsReadyForCommand] [get_bd_pins CMD_IsReadyForCommand_0]
connect_bd_net -net CMD_LoadProgramAddr_0_1 [get_bd_pins CMD_LoadProgramAddr_0] [get_bd_pins ShaderCore_0/CMD_LoadProgramAddr]
connect_bd_net -net CMD_SetVertexStreamDWORDCount_0_1 [get_bd_pins CMD_SetVertexStreamDWORDCount_0] \
  [get_bd_pins ShaderCore_0/CMD_SetVertexStreamDWORDCount]
connect_bd_net -net VBO_Ready_0_1 [get_bd_pins VBO_Ready_0] [get_bd_pins ShaderCore_0/VBO_Ready]
connect_bd_net [get_bd_pins ShaderCore_0/VBO_Pushed] [get_bd_pins VBO_Pushed_0]
connect_bd_net -net VBB_Done_0_1 [get_bd_pins VBB_Done_0] [get_bd_pins ShaderCore_0/VBB_Done]
connect_bd_net -net CMD_SetVertexStreamID_0_1 [get_bd_pins CMD_SetVertexStreamID_0] [get_bd_pins ShaderCore_0/CMD_SetVertexStreamID]
connect_bd_net -net CMD_InCommand_0_1 [get_bd_pins CMD_InCommand_0] [get_bd_pins ShaderCore_0/CMD_InCommand]
connect_bd_net -net CMD_SetVertexStreamShaderRegIndex_0_1 [get_bd_pins CMD_SetVertexStreamShaderRegIndex_0] \
  [get_bd_pins ShaderCore_0/CMD_SetVertexStreamShaderRegIndex]
connect_bd_net [get_bd_pins ShaderCore_0/FPUALL_IN_MODE] \
  [get_bd_pins FPUALL_IN_MODE] [get_bd_pins FloatALU_0/IN_MODE] [get_bd_pins FloatALU_1/IN_MODE] \
  [get_bd_pins FloatALU_2/IN_MODE] [get_bd_pins FloatALU_3/IN_MODE]
connect_bd_net [get_bd_pins ShaderCore_0/FPUALL_ISHFT_GO] \
  [get_bd_pins FPUALL_ISHFT_GO] [get_bd_pins FloatALU_0/ISHFT_GO] [get_bd_pins FloatALU_1/ISHFT_GO] \
  [get_bd_pins FloatALU_2/ISHFT_GO] [get_bd_pins FloatALU_3/ISHFT_GO]
connect_bd_net [get_bd_pins ShaderCore_0/FPUALL_IMUL_GO] \
  [get_bd_pins FPUALL_IMUL_GO] [get_bd_pins FloatALU_0/IMUL_GO] [get_bd_pins FloatALU_1/IMUL_GO] \
  [get_bd_pins FloatALU_2/IMUL_GO] [get_bd_pins FloatALU_3/IMUL_GO]
connect_bd_net [get_bd_pins ShaderCore_0/FPUALL_IADD_GO] \
  [get_bd_pins FPUALL_IADD_GO] [get_bd_pins FloatALU_0/IADD_GO] [get_bd_pins FloatALU_1/IADD_GO] \
  [get_bd_pins FloatALU_2/IADD_GO] [get_bd_pins FloatALU_3/IADD_GO]
connect_bd_net [get_bd_pins ShaderCore_0/FPUALL_ICMP_GO] \
  [get_bd_pins FPUALL_ICMP_GO] [get_bd_pins FloatALU_0/ICMP_GO] [get_bd_pins FloatALU_1/ICMP_GO] \
  [get_bd_pins FloatALU_2/ICMP_GO] [get_bd_pins FloatALU_3/ICMP_GO]
connect_bd_net [get_bd_pins ShaderCore_0/FPUALL_ICNV_GO] \
  [get_bd_pins FPUALL_ICNV_GO] [get_bd_pins FloatALU_0/ICNV_GO] [get_bd_pins FloatALU_1/ICNV_GO] \
  [get_bd_pins FloatALU_2/ICNV_GO] [get_bd_pins FloatALU_3/ICNV_GO]
connect_bd_net [get_bd_pins ShaderCore_0/FPUALL_ISPEC_GO] \
  [get_bd_pins FPUALL_ISPEC_GO] [get_bd_pins FloatALU_0/ISPEC_GO] [get_bd_pins FloatALU_1/ISPEC_GO] \
  [get_bd_pins FloatALU_2/ISPEC_GO] [get_bd_pins FloatALU_3/ISPEC_GO]
connect_bd_net [get_bd_pins ShaderCore_0/DBG_InstructionPointer] [get_bd_pins DBG_InstructionPointer]
connect_bd_net [get_bd_pins ShaderCore_0/DBG_CurrentlyExecutingInstruction] [get_bd_pins DBG_CurrentlyExecutingInstruction]
connect_bd_net [get_bd_pins VertexStreamCache_0/DBG_State] [get_bd_pins DBG_State]
connect_bd_net [get_bd_pins VertexStreamCache_0/VertexCache_dina] [get_bd_pins VertexCache_dina] [get_bd_pins VB_Cache/dina]
connect_bd_net [get_bd_pins VertexStreamCache_0/VertexCache_addra] [get_bd_pins VertexCache_addra] [get_bd_pins VB_Cache/addra]
connect_bd_net [get_bd_pins VB_Cache/douta] [get_bd_pins douta] [get_bd_pins VertexStreamCache_0/VertexCache_douta]
connect_bd_net [get_bd_pins ShaderCore_0/DBG_CurrentState] [get_bd_pins DBG_CurrentState]
connect_bd_net [get_bd_pins ShaderCore_0/DBG_CurrentFetchWave] [get_bd_pins DBG_CurrentFetchWave]
connect_bd_net [get_bd_pins ShaderCore_0/DBG_CurrentDWORD] [get_bd_pins DBG_CurrentDWORD]
connect_bd_net [get_bd_pins ShaderCore_0/DBG_ReadRegisterOutDataReady] [get_bd_pins DBG_ReadRegisterOutDataReady]
connect_bd_net [get_bd_pins ShaderCore_0/DBG_ReadRegisterOutData] [get_bd_pins DBG_ReadRegisterOutData]
connect_bd_net [get_bd_pins DBG_ReadRegisterOutRequest] [get_bd_pins ShaderCore_0/DBG_ReadRegisterOutRequest]
connect_bd_net [get_bd_pins ShaderCore_0/DBG_PortW_MUX] [get_bd_pins DBG_PortW_MUX]
connect_bd_net [get_bd_pins ShaderCore_0/FPUALL_IBIT_GO] \
  [get_bd_pins FloatALU_0/IBIT_GO] [get_bd_pins FloatALU_1/IBIT_GO] [get_bd_pins FloatALU_2/IBIT_GO] \
  [get_bd_pins FloatALU_3/IBIT_GO]
connect_bd_net [get_bd_pins ShaderCore_0/VBO_NumVertices] [get_bd_pins VBO_NumVertices]
connect_bd_net [get_bd_pins ShaderCore_0/VBO_NumIndices] [get_bd_pins VBO_NumIndices]
connect_bd_net [get_bd_pins ShaderCore_0/VBO_IsIndexedDrawCall] [get_bd_pins VBO_IsIndexedDrawCall]
connect_bd_net [get_bd_pins ShaderCore_0/DBG_ActiveLanesBitmask] [get_bd_pins DBG_ActiveLanesBitmask]
connect_bd_net [get_bd_pins ShaderCore_0/STAT_CyclesIdle] [get_bd_pins STAT_CyclesIdle]
connect_bd_net [get_bd_pins ShaderCore_0/STAT_CyclesSpentWorking] [get_bd_pins STAT_CyclesSpentWorking]
connect_bd_net [get_bd_pins ShaderCore_0/STAT_CyclesExecShaderCode] [get_bd_pins STAT_CyclesExecShaderCode]
connect_bd_net [get_bd_pins ShaderCore_0/STAT_CyclesWaitingForOutput] [get_bd_pins STAT_CyclesWaitingForOutput]
connect_bd_net [get_bd_pins ShaderCore_0/STAT_CurrentDrawEventID] [get_bd_pins STAT_CurrentDrawEventID]
connect_bd_net [get_bd_pins ShaderCore_0/CMD_IsIdle] [get_bd_pins CMD_IsIdle]
connect_bd_net [get_bd_pins ShaderCore_0/VERTBATCH_FIFO_rd_en] [get_bd_pins VERTBATCH_FIFO_rd_en]
connect_bd_net [get_bd_pins VERTBATCH_FIFO_empty] [get_bd_pins ShaderCore_0/VERTBATCH_FIFO_empty]

current_bd_instance /ShaderCoreSystem/GPRQuadSystem
connect_bd_intf_net [get_bd_intf_pins GPRQuad2_0/BRAM0W] [get_bd_intf_pins blk_mem_gen_0/BRAM_PORTA]
connect_bd_intf_net [get_bd_intf_pins GPRQuad2_0/BRAM0R] [get_bd_intf_pins blk_mem_gen_0/BRAM_PORTB]
connect_bd_intf_net [get_bd_intf_pins GPRQuad2_0/BRAM1W] [get_bd_intf_pins blk_mem_gen_1/BRAM_PORTA]
connect_bd_intf_net [get_bd_intf_pins GPRQuad2_0/BRAM1R] [get_bd_intf_pins blk_mem_gen_1/BRAM_PORTB]
connect_bd_intf_net [get_bd_intf_pins GPRQuad2_0/BRAM2W] [get_bd_intf_pins blk_mem_gen_2/BRAM_PORTA]
connect_bd_intf_net [get_bd_intf_pins GPRQuad2_0/BRAM2R] [get_bd_intf_pins blk_mem_gen_2/BRAM_PORTB]
connect_bd_intf_net [get_bd_intf_pins GPRQuad2_0/BRAM3W] [get_bd_intf_pins blk_mem_gen_3/BRAM_PORTA]
connect_bd_intf_net [get_bd_intf_pins GPRQuad2_0/BRAM3R] [get_bd_intf_pins blk_mem_gen_3/BRAM_PORTB]
connect_bd_intf_net [get_bd_intf_pins GPRQuad2_0/BRAM4W] [get_bd_intf_pins blk_mem_gen_4/BRAM_PORTA]
connect_bd_intf_net [get_bd_intf_pins GPRQuad2_0/BRAM4R] [get_bd_intf_pins blk_mem_gen_4/BRAM_PORTB]
connect_bd_intf_net [get_bd_intf_pins GPRQuad2_0/BRAM5W] [get_bd_intf_pins blk_mem_gen_5/BRAM_PORTA]
connect_bd_intf_net [get_bd_intf_pins GPRQuad2_0/BRAM5R] [get_bd_intf_pins blk_mem_gen_5/BRAM_PORTB]
connect_bd_intf_net [get_bd_intf_pins GPRQuad2_0/BRAM6W] [get_bd_intf_pins blk_mem_gen_6/BRAM_PORTA]
connect_bd_intf_net [get_bd_intf_pins GPRQuad2_0/BRAM6R] [get_bd_intf_pins blk_mem_gen_6/BRAM_PORTB]
connect_bd_intf_net [get_bd_intf_pins GPRQuad2_0/BRAM7W] [get_bd_intf_pins blk_mem_gen_7/BRAM_PORTA]
connect_bd_intf_net [get_bd_intf_pins GPRQuad2_0/BRAM7R] [get_bd_intf_pins blk_mem_gen_7/BRAM_PORTB]
connect_bd_net -net clk_0_1 [get_bd_pins clk_0] [get_bd_pins GPRQuad2_0/clk]
connect_bd_net -net portW_en_0_1 [get_bd_pins portW_en_0] [get_bd_pins GPRQuad2_0/portW_en]
connect_bd_net -net writeQuadIndex_0_1 [get_bd_pins writeQuadIndex_0] [get_bd_pins GPRQuad2_0/writeQuadIndex]
connect_bd_net -net portB_regType_0_1 [get_bd_pins portB_regType_0] [get_bd_pins GPRQuad2_0/portB_regType]
connect_bd_net -net portW_regType_0_1 [get_bd_pins portW_regType_0] [get_bd_pins GPRQuad2_0/portW_regType]
connect_bd_net -net readQuadIndex_0_1 [get_bd_pins readQuadIndex_0] [get_bd_pins GPRQuad2_0/readQuadIndex]
connect_bd_net -net portW_regIdx_0_1 [get_bd_pins portW_regIdx_0] [get_bd_pins GPRQuad2_0/portW_regIdx]
connect_bd_net -net portA_regChan_0_1 [get_bd_pins portA_regChan_0] [get_bd_pins GPRQuad2_0/portA_regChan]
connect_bd_net [get_bd_pins GPRQuad2_0/portA_readOutData] [get_bd_pins portA_readOutData_0]
connect_bd_net -net portW_regChan_0_1 [get_bd_pins portW_regChan_0] [get_bd_pins GPRQuad2_0/portW_regChan]
connect_bd_net -net portA_regType_0_1 [get_bd_pins portA_regType_0] [get_bd_pins GPRQuad2_0/portA_regType]
connect_bd_net -net portW_writeInData_0_1 [get_bd_pins portW_writeInData_0] [get_bd_pins GPRQuad2_0/portW_writeInData]
connect_bd_net -net portA_regIdx_0_1 [get_bd_pins portA_regIdx_0] [get_bd_pins GPRQuad2_0/portA_regIdx]
connect_bd_net -net portB_en_0_1 [get_bd_pins portB_en_0] [get_bd_pins GPRQuad2_0/portB_en]
connect_bd_net -net portA_en_0_1 [get_bd_pins portA_en_0] [get_bd_pins GPRQuad2_0/portA_en]
connect_bd_net -net portB_regIdx_0_1 [get_bd_pins portB_regIdx_0] [get_bd_pins GPRQuad2_0/portB_regIdx]
connect_bd_net -net portB_regChan_0_1 [get_bd_pins portB_regChan_0] [get_bd_pins GPRQuad2_0/portB_regChan]
connect_bd_net [get_bd_pins GPRQuad2_0/portB_readOutData] [get_bd_pins portB_readOutData_0]
